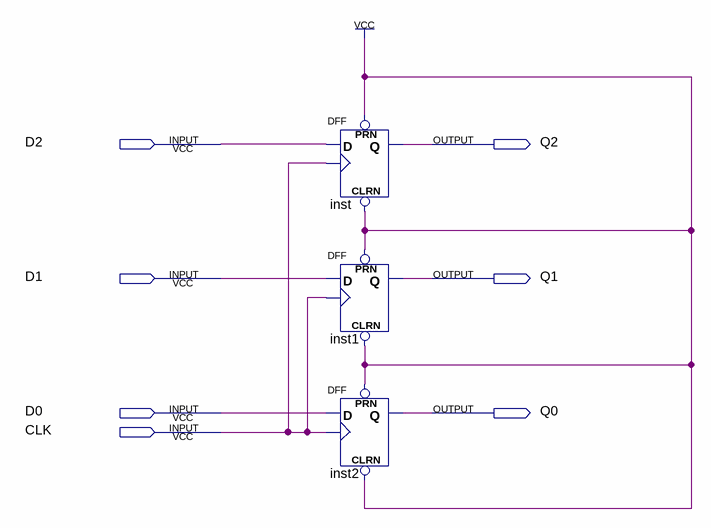
[diagram p0: schematic sheet]
// Quartus schematic block10.bdf as structural Verilog: 3 symbols, 7 pins
module block10 (
  input  D2,
  input  D1,
  input  D0,
  input  CLK,
  output Q2,
  output Q1,
  output Q0
);

  DFF inst (.CLRN(1'b1), .CLK(CLK), .D(D2), .PRN(1'b1), .Q(Q2));
  DFF inst1 (.CLRN(1'b1), .CLK(CLK), .D(D1), .PRN(1'b1), .Q(Q1));
  DFF inst2 (.CLRN(1'b1), .CLK(CLK), .D(D0), .PRN(1'b1), .Q(Q0));
endmodule
